# Altium schematic sheet HVP012A.SchDoc
size 431 x 279 mm; Date: Not shown in title block; ApprovedBy: Not shown in title block; CheckedBy: Not shown in title block; Author: Not shown in title block; CompanyName: Not shown in title block; Engineer: Not shown in title block; Organization: Not shown in title block; Address1: Not shown in title block; Address2: Not shown in title block; Address3: Not shown in title block; Address4: Not shown in title block; DocumentNumber: 1; Revision: Use project parameter SCH_Rev; SheetNumber: 1; SheetTotal: 1; PageSetup: Record=PageOptions|CenterHorizontal=True|CenterVertical=True|PrintScale=0.64|XCorrection=1.00|YCorrection=1.00|PrintKind=0|BorderSize=5000000|LeftOffset=0|BottomOffset=0|Orientation=2|PaperLength=1000|PaperWidth=1000|Scale=100|PaperSource=15|PrintQuality=600|MediaType=1|DitherType=10|PrintScaleMode=1|PaperKind=Letter; CurrentTime: Not shown in title block; CurrentDate: Not shown in title block; Time: Not shown in title block; DocumentFullPathAndName: Not shown in title block; DocumentName: Not shown in title block; ModifiedDate: Not shown in title block; ImagePath: Not shown in title block
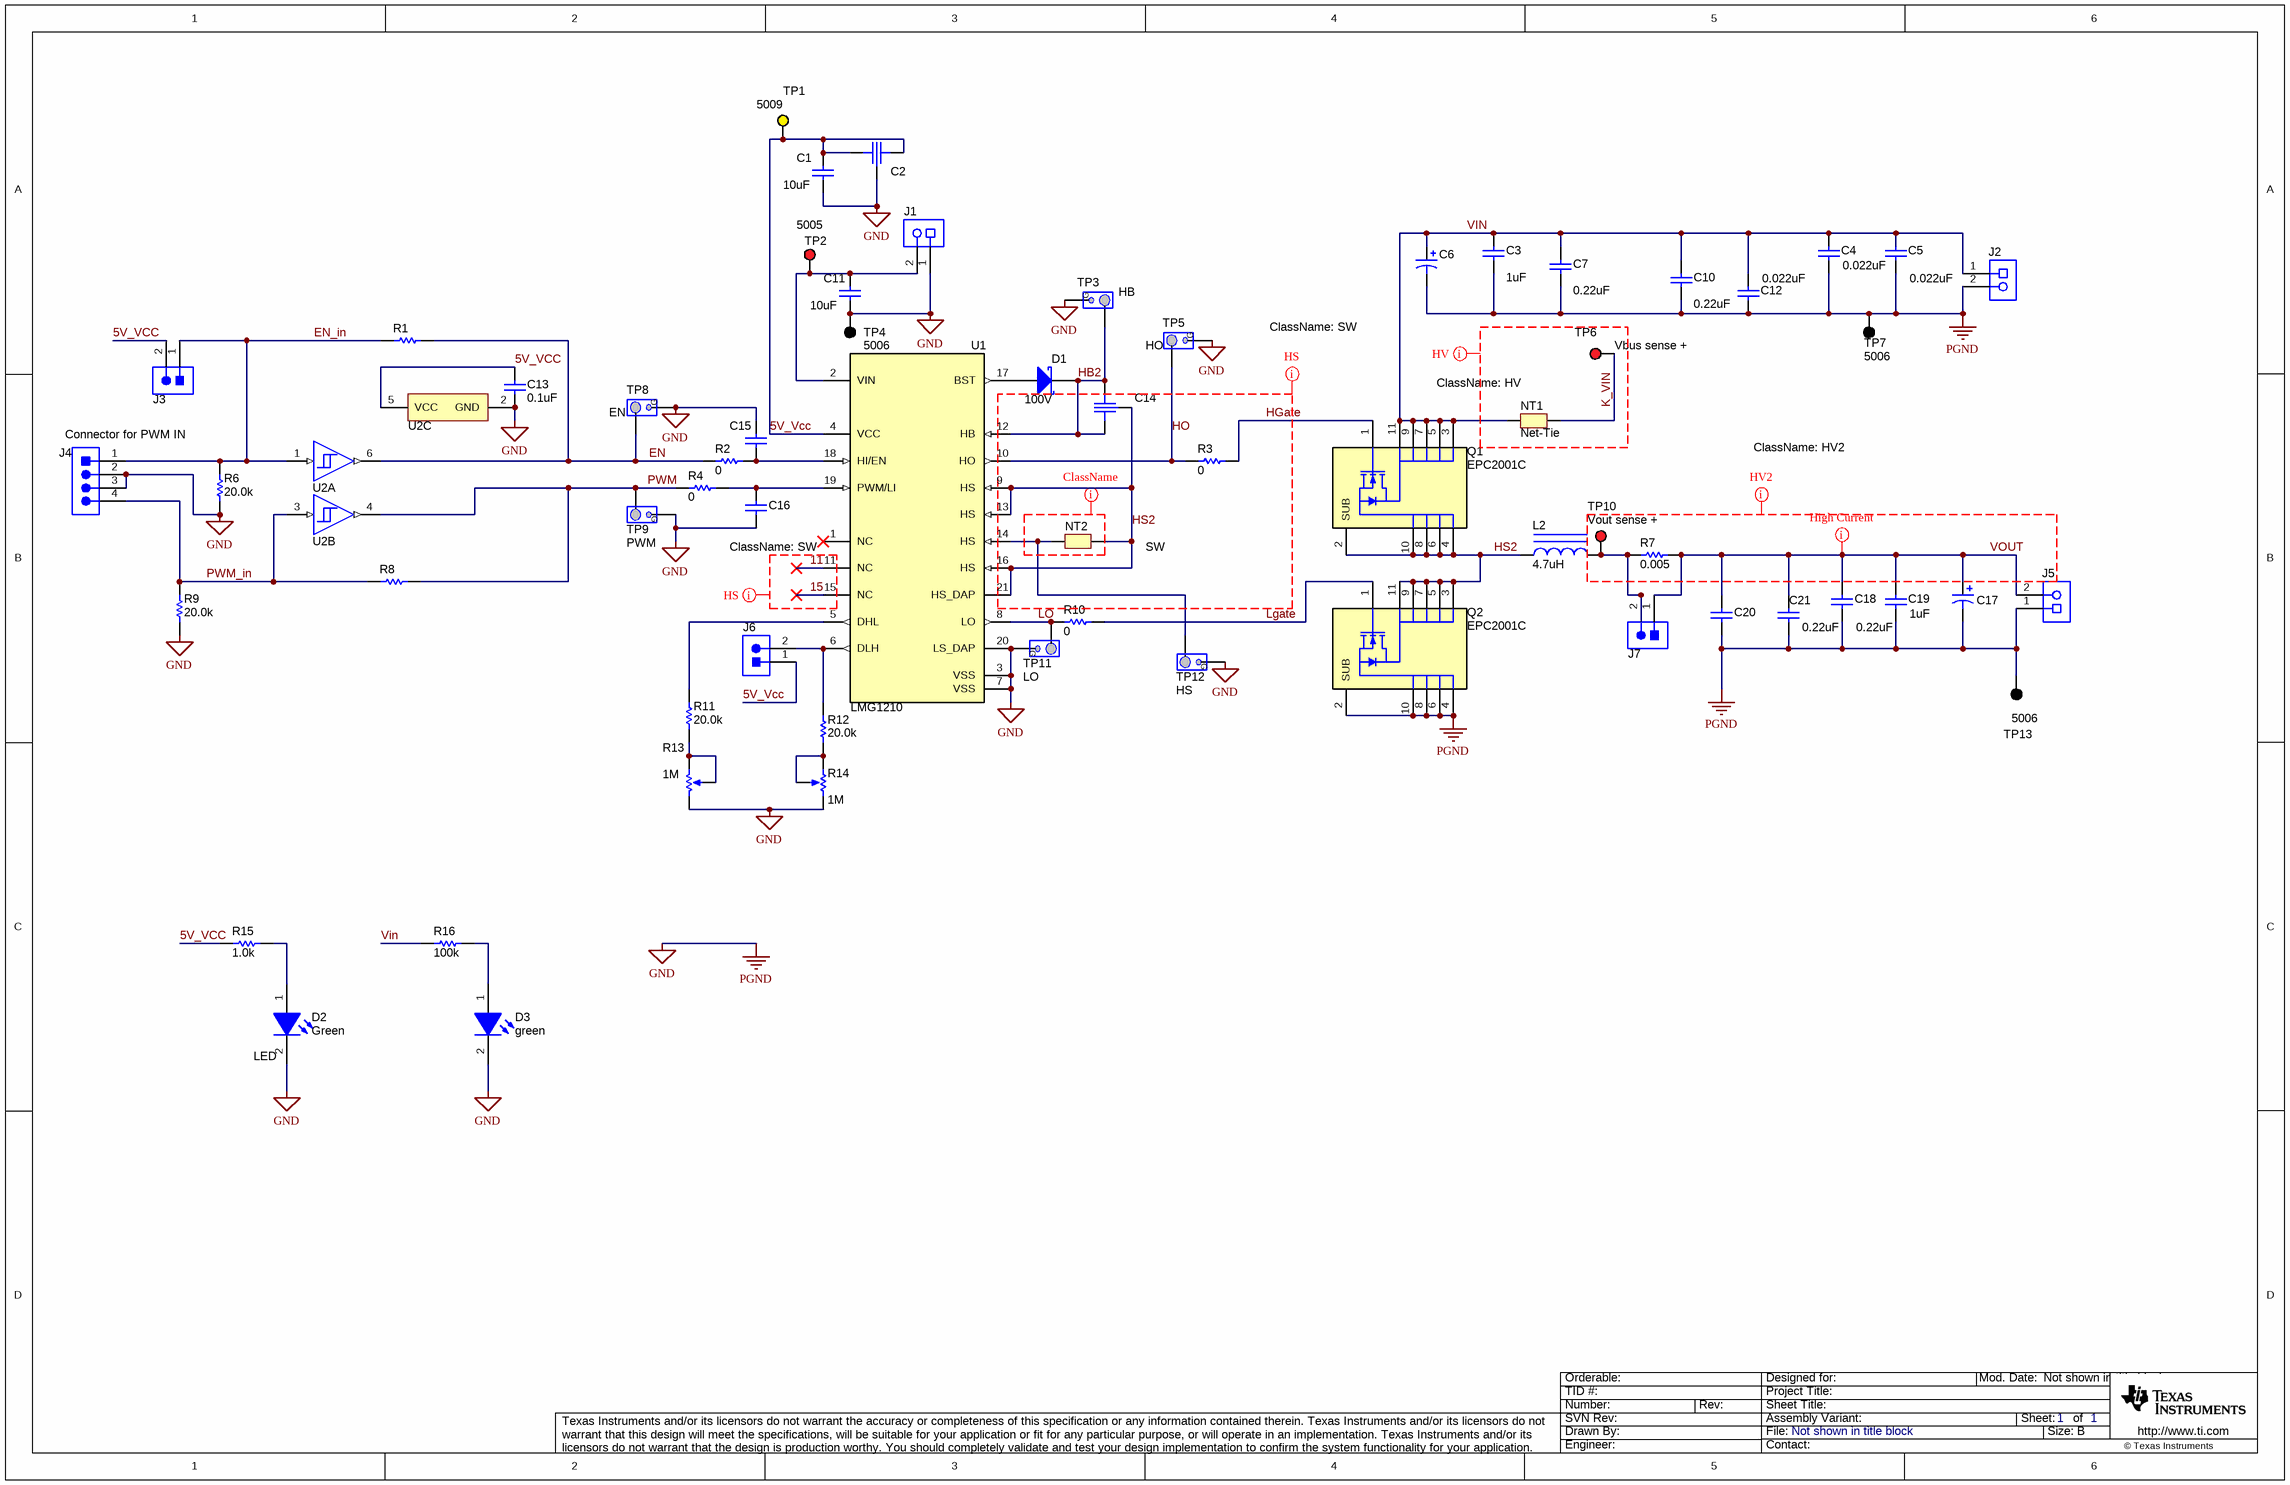
[diagram p0: HVP012A.SchDoc]

## Parts
(Parts that share a designator on the sheet are numbered #1, #2 ... from top to bottom, then left to right.)
C1  ValueDisplayed: 10uF  [1206]  (hidden comment: Capacitor)
C2  Capacitor_Balanced  [YFF18PW]  (value not drawn)
C3  ValueDisplayed: 1uF  [2220_200]  (hidden comment: Capacitor)
C4  ValueDisplayed: 0.022uF  [0805_HV]  (hidden comment: Capacitor)
C5  ValueDisplayed: 0.022uF  [0805_HV]  (hidden comment: Capacitor)
C6  Cap_Polarized  [CAPSMT_62_F60]  (value not drawn)
C7  ValueDisplayed: 0.22uF  [1210_220]  (hidden comment: Capacitor)
C10  ValueDisplayed: 0.22uF  [1210_220]  (hidden comment: Capacitor)
C11  ValueDisplayed: 10uF  [1206]  (hidden comment: Capacitor)
C12  ValueDisplayed: 0.022uF  [0805_HV]  (hidden comment: Capacitor)
C13  ValueDisplayed: 0.1uF  [0603]  (hidden comment: Capacitor)
C14  Capacitor_Balanced  [YFF18PW]  (value not drawn)
C15  Capacitor  [0402]  (value not drawn)
C16  Capacitor  [0402]  (value not drawn)
C17  Cap_Polarized  [CAPSMT_62_H70]  (value not drawn)
C18  ValueDisplayed: 0.22uF  [1210_220]  (hidden comment: Capacitor)
C19  ValueDisplayed: 1uF  [2220_200]  (hidden comment: Capacitor)
C20  Capacitor  [1210_220]  (value not drawn)
C21  ValueDisplayed: 0.22uF  [1210_220]  (hidden comment: Capacitor)
D1  value 100V  [SOD-323F]  (hidden comment: BAT46WJ,115)
D2  LED  value Green  [LTST-C170KGKT_Green]
D3  green  [LTST-C170KGKT_Green]
J1  Receptacle_2x1  [On-Shore_OSTVN02A150]  (value not drawn)
J2  Receptacle_2x1  [TEC_282841-2]  (value not drawn)
J3  Header_2x1  [Sullins_Gxx02SAAN]  (value not drawn)
J4  Header_4x1  [TE_5-146278-4]  (value not drawn)
J5  Receptacle_2x1  [TEC_282841-2]  (value not drawn)
J6  Header_2x1  [Sullins_Gxx02SAAN]  (value not drawn)
J7  Header_2x1  [Sullins_Gxx02SAAN]  (value not drawn)
L2  ValueDisplayed: 4.7uH  [XAL8080]  (hidden comment: Inductor_Iron)
NT1  Net-Tie  [Net-Tie_10milWide_30milLong]  (net tie, no BOM)
NT2  Net-Tie  [Net-Tie_10milWide_30milLong]  (value not drawn)  (net tie, no BOM)
Q1  EPC2001C  [EPC2001]
Q2  EPC2001C  [EPC2001]
R1  Resistor  [0402]  (value not drawn)
R2  ValueDisplayed: 0  [0402]  (hidden comment: Resistor)
R3  ValueDisplayed: 0  [0201]  (hidden comment: Resistor)
R4  ValueDisplayed: 0  [0402]  (hidden comment: Resistor)
R6  ValueDisplayed: 20.0k  [0402]  (hidden comment: Resistor)
R7  ValueDisplayed: 0.005  [0612]  (hidden comment: PRL1632-R005-F-T1)
R8  Resistor  [0402]  (value not drawn)
R9  ValueDisplayed: 20.0k  [0402]  (hidden comment: Resistor)
R10  ValueDisplayed: 0  [0201]  (hidden comment: Resistor)
R11  ValueDisplayed: 20.0k  [0201]  (hidden comment: Resistor)
R12  ValueDisplayed: 20.0k  [0201]  (hidden comment: Resistor)
R13  value 1M  [TRIM_3224X]  (hidden comment: Potentiometer)
R14  value 1M  [TRIM_3224X]  (hidden comment: Potentiometer)
R15  value 1.0k  [0603]  (hidden comment: Resistor)
R16  ValueDisplayed: 100k  [1206]  (hidden comment: Resistor)
TP1  5009  [Keystone5009]
TP2  5005  [Keystone5005]
TP3  HB  [TESTPOINT_PIGTAIL]  (no BOM)
TP4  5006  [Keystone5006]
TP5  HO  [TESTPOINT_PIGTAIL]  (no BOM)
TP6  Vbus sense +  [Keystone5000]
TP7  5006  [Keystone5006]
TP8  EN  [TESTPOINT_PIGTAIL]  (no BOM)
TP9  PWM  [TESTPOINT_PIGTAIL]  (no BOM)
TP10  Vout sense +  [Keystone5000]
TP11  LO  [TESTPOINT_PIGTAIL]  (no BOM)
TP12  HS  [TESTPOINT_PIGTAIL]  (no BOM)
TP13  5006  [Keystone5006]
U1  LMG1210  [RVR0019A]
U2#1  SN74LVC2G17DBVR  [DBV0006A_N]  (value not drawn)  (parts A,C of 3)
U2#2  SN74LVC2G17DBVR  [DBV0006A_N]  (value not drawn)  (part B of 3)

## Nets
GND: C1.2 C2.3 C3.2 C4.2 C5.2 C6.2(-) C7.2 C10.2 C11.1 C12.2 C13.2 C15.1 C16.2 C17.2(-) C18.2 C19.2 C20.2 C21.2 D2.2(K) D3.2(K) J1.1 J2.2 J4.2 J4.3 J5.1 Q2.2(SUB) Q2.4(S) Q2.6(S) Q2.8(S) Q2.10(S) R6.1 R9.1 R13.3(CW) R14.3(CW) TP3.2 TP4.1 TP5.2 TP7.1 TP8.2 TP9.2 TP11.2 TP12.2 TP13.1 U1.3(VSS) U1.7(VSS) U1.20(LS_DAP) U2#1.2(GND)  [also labelled PGND]
5V_Vcc: C1.1 C2.1 C2.2 C13.1 J3.2 J6.1 R15.1 TP1.1 U1.4(VCC) U2#1.5(VCC)
11: U1.11(NC)
15: U1.15(NC)
EN: R1.2 R2.1 TP8.1 U2#1.6(1Y)
EN_in: J3.1 J4.1 R1.1 R6.2 U2#1.1(1A)
HB2: C14.1 C14.2 D1.1(K) TP3.1 U1.12(HB)
HGate: Q1.1(G) R3.2
HO: R3.1 TP5.1 U1.10(HO)
HS2: C14.3 L2.1 NT2.2 Q1.2(SUB) Q1.4(S) Q1.6(S) Q1.8(S) Q1.10(S) Q2.3(D) Q2.5(D) Q2.7(D) Q2.9(D) Q2.11(D) U1.9(HS) U1.13(HS) U1.16(HS) U1.21(HS_DAP)
K_VIN: NT1.2 TP6.1
Lgate: Q2.1(G) R10.2
LO: R10.1 TP11.1 U1.8(LO)
PWM: R4.1 R8.2 TP9.1 U2#2.4(2Y)
PWM_in: J4.4 R8.1 R9.2 U2#2.3(2A)
Vin: C3.1 C4.1 C5.1 C6.1(+) C7.1 C10.1 C12.1 J2.1 NT1.1 Q1.3(D) Q1.5(D) Q1.7(D) Q1.9(D) Q1.11(D) R16.1
VOUT: C17.1(+) C18.1 C19.1 C20.1 C21.1 J5.2 J7.1 R7.2
NetC11_2: C11.2 J1.2 TP2.1 U1.2(VIN)
NetC15_2: C15.2 R2.2 U1.18(HI/EN)
NetC16_1: C16.1 R4.2 U1.19(PWM/LI)
NetD1_2: D1.2(A) U1.17(BST)
NetD2_1: D2.1(A) R15.2
NetD3_1: D3.1(A) R16.2
NetJ6_2: J6.2 R12.2 U1.6(DLH)
NetJ7_2: J7.2 L2.2 R7.1 TP10.1
NetNT2_1: NT2.1 TP12.1 U1.14(HS)
NetR11_1: R11.1 R13.1(CCW) R13.2(WIPER)
NetR11_2: R11.2 U1.5(DHL)
NetR12_1: R12.1 R14.1(CCW) R14.2(WIPER)

Not connected (* = marked no-connect by the designer): U1 1(NC)*

## Layout directives
mark named High Current: VOUT
net class HV: K_VIN
net class SW: 11, 15, HGate, HO, HS2
net class HV2: VOUT

## Notes on the sheet
- (near J4) Connector for PWM IN
- Drawn By:
- SVN Rev:
- Number:
- TID #:
- Orderable:
- Rev:
- Sheet Title:
- File:
- Project Title:
- Designed for:
- Assembly Variant:
- Mod. Date:
- Sheet:
- Size:
- of
- B
- http://www.ti.com
- Texas Instruments and/or its licensors do not warrant the accuracy or completeness of this specification or any information contained therein. Texas Instruments and/or its licensors do not warrant that this design will meet the specifications, will be suitable for your application or fit for any particular purpose, or will operate in an implementation. Texas Instruments and/or its licensors do not warrant that the design is production worthy. You should completely validate and test your design implementation to confirm the system functionality for your application.
- Engineer:
- Contact:
- © Texas Instruments
- (in symbol CMP-0003907-1) G

## Library data of the parts
C1 C11 = CMP-0008574-2: CAP, CERM, 10 uF, 25 V, +/- 10%, X7R, 1206; PartNumber: 885012208069; Manufacturer: Wurth Elektronik; Polarized: N; Value: 10uF; U/M: EA; Cap_F: 10µF; Value1: Unknown; VDC_V: 25V; TaMin_C: -55°C; TaMax_C: 125°C; AEC Category: Q200; SizeArea_mm2: 5.12; SizeAreaWB_mm2: 10.92; SizeX_mm: 3.2; SizeY_mm: 1.6; SizeZ_mm: 1.35; CompType: Capacitor; PackageReference: 1206; RoHS: Y; Tolerance_%: 10%; Value2: 25V; MountType: SMT; Technology: Ceramic; TempCo: X7R; Cap_Case: 1206; Published: 2008-06-19; Publisher: Texas Instruments; LatestRevisionDate: 2017-03-09; ComponentLink1Description: Datasheet link; ComponentLink1URL: http://katalog.we-online.de/pbs/datasheet/885012208069.pdf; Supplier 1: Digi-Key; Supplier Part Number 1: 732-7574-1-ND; Supplier 2: Mouser; Supplier Part Number 2: 710-885012208069; AEC Qualified: N; AEC Grade: N/A
C2 C14 = CMP-0002107-2: Feedthru Capacitor, 0.47uF, 6.3V, SMD; PartNumber: YFF18PW0J474M; Manufacturer: TDK; CompType: Filter; Value: 0.47uF; MountType: SMT; ComponentLink1Description: Datasheet URL; ComponentLink1URL: http://product.tdk.com/en/catalog/datasheets/emc_esr_yff-p_en.pdf; RoHS: Y; PackageReference: 0603; Publisher: Texas Instruments; LatestRevisionDate: 09/03/2017; Supplier 1: Digi-Key; Supplier Part Number 1: 445-3028-1-ND; Supplier 2: Mouser; Supplier Part Number 2: 810-CKD61BJB0J474S
C3 C19 = CMP-0009465-2: CAP, CERM, 1 uF, 250 V, +/- 10%, X7R, 2220; PartNumber: GRM55DR72E105KW01L; Manufacturer: MuRata; Polarized: N; Value: 1uF; U/M: EA; Cap_F: 1µF; ESR_ohm: 7.086m; Value1: 0.007086 ohm; VDC_V: 250V; IRMS_A: 2.0605A; TaMin_C: -55°C; TaMax_C: 125°C; Cap_Case: 2220; SizeArea_mm2: 28.5; SizeAreaWB_mm2: 53.9; SizeX_mm: 5.7; SizeY_mm: 5; SizeZ_mm: 2; AEC Category: Q200; CompType: Capacitor; PackageReference: 2220; RoHS: Y; Tolerance_%: 10%; Value2: 250V; MountType: SMT; Technology: Ceramic; TempCo: X7R; Published: 2008-06-19; Publisher: Texas Instruments; LatestRevisionDate: 2017-03-09; ComponentLink1Description: Datasheet link; ComponentLink1URL: http://psearch.en.murata.com/capacitor/product/GRM55DR72E105KW01%23.pdf; Supplier 1: Digi-Key; Supplier Part Number 1: 490-3550-1-ND; Supplier 2: Newark; Supplier Part Number 2: 14T3417; Supplier 3: Mouser; Supplier Part Number 3: 81-GRM55RR72E105K; AEC Qualified: N; AEC Grade: N/A
C4 C5 C12 = CMP-0008410-2: CAP, CERM, 0.022 uF, 250 V, +/- 10%, X7R, 0805; PartNumber: QMK212B7223KG-T; Manufacturer: Taiyo Yuden; Polarized: N; U/M: EA; Cap_F: 22nF; Value1: Unknown; VDC_V: 250V; TaMin_C: -55°C; TaMax_C: 125°C; Cap_Case: 0805; SizeArea_mm2: 2.5; SizeAreaWB_mm2: 6.75; SizeX_mm: 2; SizeY_mm: 1.25; SizeZ_mm: 1.45; AEC Category: Q200; CompType: Capacitor; Value: 0.022uF; PackageReference: 0805; RoHS: Y; Tolerance_%: 10%; Value2: 250V; MountType: SMT; Technology: Ceramic; TempCo: X7R; Published: 2008-06-19; Publisher: Texas Instruments; LatestRevisionDate: 2017-03-09; ComponentLink1Description: Datasheet link; ComponentLink1URL: http://www.yuden.co.jp/ut/product/pdf/dhmk_e.pdf; Supplier 1: Digi-Key; Supplier Part Number 1: 587-1272-1-ND; Supplier 2: Newark; Supplier Part Number 2: 77M8478; Supplier 3: Farnell; Supplier Part Number 3: 1683685; AEC Qualified: ?
C6 = CMP-0010616-1: CAP, AL, 22 uF, 20 V, +/- 20%, 0.06 ohm, SMD; PartNumber: APXH200ARA220MF60G; Manufacturer: Chemi-Con; Polarized: Y; CompType: Capacitor; Value: 22uF; U/M: EA; Cap_F: 22µF; VDC_V: 20V; ESR_ohm: 0.06; IRMS_A: 1.65A; TaMin_C: -55°C; TaMax_C: 125°C; Cap_Case: F60; SizeAreaWB_mm2: 77.44; SizeArea_mm2: 46.24; SizeX_mm: 6.8; SizeZ_mm: 6; AEC Category: Q200; ValueDisplayed: 22uF; PackageReference: F60; RoHS: Y; Tolerance_%: 20%; Value1: 0.06 ohm; Value2: 20V; MountType: SMT; Technology: AL; Series: PXH; SizeY_mm: 6.8; Publisher: Texas Instruments; LatestRevisionDate: 2017-03-09; ComponentLink1Description: Datasheet link; ComponentLink1URL: http://www.chemi-con.co.jp/cgi-bin/CAT_DB/SEARCH/cat_db_al.cgi?e=e&j=p&pdfname=pxh; Supplier 1: Digi-Key; Supplier Part Number 1: 565-3149-1-ND; Supplier 2: Mouser; Supplier Part Number 2: 661-PXH20V220M; AEC Qualified: ?
C7 C10 C18 C20 C21 = CMP-0009193-2: CAP, CERM, 0.22 uF, 250 V, +/- 10%, X7R, 1210; PartNumber: GRM32DR72E224KW01L; Manufacturer: MuRata; Polarized: N; Value: 0.22uF; U/M: EA; Cap_F: 220nF; Value1: Unknown; VDC_V: 250V; TaMin_C: -55°C; TaMax_C: 125°C; Cap_Case: 1210; SizeArea_mm2: 8; SizeAreaWB_mm2: 14.7; SizeX_mm: 3.2; SizeY_mm: 2.5; SizeZ_mm: 2.2; AEC Category: Q200; CompType: Capacitor; PackageReference: 1210; RoHS: Y; Tolerance_%: 10%; Value2: 250V; MountType: SMT; Technology: Ceramic; TempCo: X7R; Published: 2008-06-19; Publisher: Texas Instruments; LatestRevisionDate: 2017-03-09; ComponentLink1Description: Datasheet link; ComponentLink1URL: http://search.murata.co.jp/Ceramy/PnsearchViewAction.do?HnOFG=ON&HnNFG=ON&SEL_CNT=50&sLang=en&sKey=GRM32DR72E224KW01L&x=9&y=9&search=startwith; Supplier 1: Digi-Key; Supplier Part Number 1: 490-3545-1-ND; Supplier 2: Mouser; Supplier Part Number 2: 81-GRM32DR72E224KW01; Supplier 3: Farnell; Supplier Part Number 3: 1828959; AEC Qualified: ?
  C20: ValueDisplayed: 0.22uF
C13 = CMP-0007404-4: CAP, CERM, 0.1 uF, 25 V, +/- 10%, X7R, 0603; PartNumber: GRM188R71E104KA01D; Manufacturer: MuRata; Polarized: N; Value: 0.1uF; U/M: EA; Cap_F: 100nF; Value1: Unknown; VDC_V: 25V; TaMin_C: -55°C; TaMax_C: 125°C; AEC Category: Q200; SizeArea_mm2: 1.28; SizeAreaWB_mm2: 4.68; SizeX_mm: 1.6; SizeY_mm: 0.8; SizeZ_mm: 1; CompType: Capacitor; RoHS: Y; Tolerance_%: 10%; Value2: 25V; MountType: SMT; Technology: Ceramic; TempCo: X7R; Cap_Case: 0603; Published: 2008-06-19; Publisher: Texas Instruments; LatestRevisionDate: 2017-03-09; ComponentLink1Description: Datasheet link; ComponentLink1URL: http://search.murata.co.jp/Ceramy/PnsearchViewAction.do?HnOFG=ON&HnNFG=ON&SEL_CNT=50&sLang=en&sKey=GRM188R71E104KA01D&x=9&y=9&search=startwith; Supplier 1: Digi-Key; Supplier Part Number 1: 490-1524-1-ND; Supplier 2: Mouser; Supplier Part Number 2: 81-GRM39X104K25; Supplier 3: Farnell; Supplier Part Number 3: 1828899; AEC Qualified: ?; PackageReference: 0603
C15 C16 = CMP-0006207-2: CAP, CERM, 10 pF, 50 V, +/- 5%, C0G/NP0, 0402; PartNumber: 500R07S100JV4T; Manufacturer: Johanson Technology; Polarized: N; Value: 10pF; U/M: EA; Value1: Unknown; VDC_V: 50V; TaMin_C: -55°C; TaMax_C: 125°C; SizeArea_mm2: 0.5; SizeAreaWB_mm2: 3; SizeX_mm: 1; SizeZ_mm: 0.6; AEC Category: Q200; CompType: Capacitor; ValueDisplayed: 10pF; PackageReference: 0402; RoHS: Y; Cap_F: 10pF; Tolerance_%: 5%; Value2: 50V; MountType: SMT; Technology: Ceramic; TempCo: C0G/NP0; Cap_Case: 0402; SizeY_mm: 0.5; Published: 2008-06-19; Publisher: Texas Instruments; LatestRevisionDate: 2017-03-09; ComponentLink1Description: Datasheet link; ComponentLink1URL: http://www.johansontechnology.com/images/stories/catalog/JTI_CAT_2012_MLCC_HighQ.pdf; AEC Qualified: ?
C17 = CMP-0010617-1: CAP, AL, 47 uF, 20 V, +/- 20%, 0.045 ohm, SMD; PartNumber: APXH200ARA470MH70G; Manufacturer: Chemi-Con; Polarized: Y; CompType: Capacitor; Value: 47uF; U/M: EA; Cap_F: 47µF; VDC_V: 20V; ESR_ohm: 0.045; IRMS_A: 2A; TaMin_C: -55°C; TaMax_C: 125°C; Cap_Case: H70; SizeAreaWB_mm2: 110.25; SizeArea_mm2: 72.25; SizeX_mm: 8.5; SizeZ_mm: 7; AEC Category: Q200; ValueDisplayed: 47uF; PackageReference: H70; RoHS: Y; Tolerance_%: 20%; Value1: 0.045 ohm; Value2: 20V; MountType: SMT; Technology: AL; Series: PXH; SizeY_mm: 8.5; Publisher: Texas Instruments; LatestRevisionDate: 2017-03-09; ComponentLink1Description: Datasheet link; ComponentLink1URL: http://www.chemi-con.co.jp/cgi-bin/CAT_DB/SEARCH/cat_db_al.cgi?e=e&j=p&pdfname=pxh; Supplier 1: Digi-Key; Supplier Part Number 1: 565-3150-1-ND; Supplier 2: Mouser; Supplier Part Number 2: 661-PXH20V470M; AEC Qualified: ?
D1 = CMP-0076946-1: Diode, Schottky, 100 V, 0.25 A, SOD-323F; Manufacturer: Nexperia; SizeAreaWB_mm2: 7.875; SizeArea_mm2: 3.125; TJmax_C: 150°C; AEC Category: Q101; SizeZ_mm: 0.8; Green_REACh: Incomplete; Io_A: 2.5dA; Vf_V: 8.5dV; SizeY_mm: 1.25; Value2: 0.85V; Green_Lifecycle: Not Set; U/M: EA; Value1: 0.25A; SizeX_mm: 2.5; ComponentLink1Description: Datasheet link; RoHS: Y; Supplier Part Number 3: 771-BAT46WJ115; Supplier 1: Digi-Key; Vr_V: 100V; AEC Qualified: ?; Green_EU RoHS: Incomplete; PackageReference: SOD-323F; PartNumber: BAT46WJ,115; Publisher: Texas Instruments; Supplier Part Number 2: 81R1832; Supplier 2: Newark; Published: 2008-06-26; LatestRevisionDate: 2017-07-25; ComponentLink1URL: http://www.nexperia.com/documents/data_sheet/BAT46WJ.pdf; CompType: Diode; MountType: SMT; Supplier Part Number 1: 568-6017-1-ND; Supplier 3: Mouser; Type: Schottky; Green_EU RoHS-2: Incomplete
D2 = CMP-0002888-1: LED, Green, SMD; Manufacturer: Lite-On; PartNumber: LTST-C170KGKT; Type: AlInGaP; Vf_V: 2V; Io_A: 20mA; Value1: W; U/M: EA; CompType: LED; MountType: SMT; RoHS: Y; PackageReference: LED_0805; Value2: 2V; Color: Green; Published: 2008-07-11; Publisher: Texas Instruments; ComponentLink1URL: http://optoelectronics.liteon.com/upload/download/DS22-2000-073/S_110_LTST-C170KGKT.pdf; ComponentLink1Description: Datasheet link; LatestRevisionDate: 2017-03-09; Supplier 1: Digi-Key; Supplier Part Number 1: 160-1414-1-ND; Supplier 2: Mouser; Supplier Part Number 2: 859-LTST-C170KGKT
D3 = CMP-0002888-1: LED, Green, SMD; Manufacturer: Lite-On; PartNumber: LTST-C170KGKT; Io_A: 20mA; Value1: W; U/M: EA; Vf_V: 2V; Type: AlInGaP; ComponentLink1URL: http://optoelectronics.liteon.com/upload/download/DS22-2000-073/S_110_LTST-C170KGKT.pdf; Supplier Part Number 2: 859-LTST-C170KGKT; Publisher: Texas Instruments; Supplier 2: Mouser; Color: Green; Published: 2008-07-11; RoHS: Y; MountType: SMT; Value: Green; Supplier 1: Digi-Key; PackageReference: LED_0805; Value2: 2V; CompType: LED; LatestRevisionDate: 2017-03-09; ComponentLink1Description: Datasheet link; Supplier Part Number 1: 160-1414-1-ND
J1 = CMP-0075076-1: Terminal Block, 2.54mm, 2x1, Brass, TH; PartNumber: OSTVN02A150; Manufacturer: On-Shore Technology; CNHeader: False; CT: True; Green_Lifecycle: Not Set; Green_REACh: Incomplete; PackageReference: Terminal Block, 2.54mm, 2-pole, Brass, TH; CompType: Terminal Block; RoHS: Y; MountType: TH; ComponentLink1Description: Datasheet URL; ComponentLink1URL: http://www.on-shore.com/sites/default/files/manuals/ostvnxxa150.pdf; Publisher: Texas Instruments; LatestRevisionDate: 2017-07-12; Supplier 1: Digi-Key; Supplier Part Number 1: ED10561-ND; Green_EU RoHS-2: Incomplete; Green_EU RoHS: Incomplete
J2 J5 = CMP-0054973-1: Terminal Block, 2x1, 5.08mm, TH; PartNumber: 282841-2; Manufacturer: TE Connectivity; CNHeader: FALSE; CT: TRUE; Green_Lifecycle: Active; Green_REACh: Passed; PackageReference: 10.16x15.2x9mm; CompType: Terminal Block; RoHS: Y; MountType: TH; ComponentLink1Description: Datasheet URL; ComponentLink1URL: http://www.te.com/commerce/DocumentDelivery/DDEController?Action=srchrtrv&DocNm=282841&DocType=Customer+Drawing&DocLang=English; Publisher: Texas Instruments; LatestRevisionDate: 26/05/2017; Supplier 1: Digi-Key; Supplier Part Number 1: A98342-ND; Supplier 2: Newark; Supplier Part Number 2: 12H8419; Supplier 3: Mouser; Supplier Part Number 3: 571-2828412; Green_EU RoHS-2: Incomplete; Green_EU RoHS: Passed with Exemption
J3 J6 J7 = CMP-0054576-1: Header, 2.54 mm, 2x1, Gold, TH; PartNumber: GBC02SAAN; Manufacturer: Sullins Connector Solutions; CNHeader: TRUE; CT: FALSE; PackageReference: Header, 2.54 mm, 2x1, TH; ClassName: Header; CompType: Header; RoHS: Y; MountType: TH; ComponentLink1Description: Datasheet URL; ComponentLink1URL: http://www.sullinscorp.com/catalogs/111_PAGE110-111_.100_MALE_HDR.pdf; Publisher: Texas Instruments; LatestRevisionDate: 26/05/2017
J4 = CMP-0054950-1: Header, 100mil, 4x1, Tin, TH; PartNumber: 5-146278-4; Manufacturer: TE Connectivity; CNHeader: TRUE; CT: FALSE; Green_Lifecycle: Active; Green_REACh: Passed; PackageReference: Header, 4x1, 100mil, TH; ClassName: Header; CompType: Header; RoHS: Y; MountType: TH; ComponentLink1Description: Datasheet URL; ComponentLink1URL: http://www.te.com/commerce/DocumentDelivery/DDEController?Action=srchrtrv&DocNm=146278&DocType=Customer+Drawing&DocLang=English; Publisher: Texas Instruments; LatestRevisionDate: 26/05/2017; Supplier 1: Digi-Key; Supplier Part Number 1: 5-146278-4-ND; Supplier 2: Newark; Supplier Part Number 2: 40P2617; Supplier 3: Mouser; Supplier Part Number 3: 571-5-146278-4; Green_EU RoHS-2: Incomplete; Green_EU RoHS: Passed
L2 = CMP-0061062-1: Inductor, Shielded, Composite, 4.7 uH, 10.5 A, 0.00889 ohm, SMD; PartNumber: XAL8080-472ME; Manufacturer: Coilcraft; Value: 4.7uH; Ind_H: 4.7µH; Imax_A: 10.5A; Irms: 10.5A @ 20C rise; Isat: 17.4A @ 20% inductance drop; DCR_ohm: 8.89m; SizeAreaWB_mm2: 107.06; SizeArea_mm2: 69.66; SizeX_mm: 8.1; SizeY_mm: 8.6; SizeZ_mm: 8; AEC Category: Q200; Green_Lifecycle: Not Set; Green_REACh: Incomplete; CompType: Inductor; Value1: 0.00889 ohm; Value2: 10.5A; Technology: Shielded; MountType: SMT; Material: Composite; PackageReference: 8.1 x 8 x 8.6mm; Published: 2008-06-26; Publisher: Texas Instruments; LatestRevisionDate: 2017-06-02; ComponentLink1Description: Datasheet link; ComponentLink1URL: http://www.coilcraft.com/pdfs/xal8080.pdf; RoHS: Y; Supplier 1: Mouser; Supplier Part Number 1: 994-XAL8080-472MEB; Supplier 2: Farnell; Supplier Part Number 2: 2289135; AEC Qualified: ?; Green_EU RoHS-2: Incomplete; Green_EU RoHS: Incomplete
NT1 NT2 = CMP-0078142-1: Single point connection between nets.; MountType: SMT; CompType: Net-Tie; Manufacturer: N/A; PackageReference: N/A; PartNumber: N/A; Library Reference: Net-Tie
Q1 Q2 = CMP-0000972-2: MOSFET, N-CH, 100 V, 36 A, 4.105x1.632mm; Alternate Manufacturer: None; Manufacturer: EPC; SizeZ_mm: 0.815; ChType: N; Value2: 7.5 nC; VdsMax_V: 100V; SizeX_mm: 1.632; SizeAreaWB_mm2: 13.43636; SizeY_mm: 4.105; Vgs_V: 6V; QgTyp_nC: 7.5; Value: 100V; SizeArea_mm2: 6.69936; AEC Category: Q101; IdsMax_A: 36A; U/M: EA; Supplier 1: Digi-Key; Supplier Part Number 1: 917-1079-1-ND; PartNumber: EPC2001C; ComponentLink1Description: Datasheet link; CompType: MOSFET; LatestRevisionNote: Added parts.; Publisher: Texas Instruments; AEC Qualified: N; Published: 2008-06-19; RoHS: Y; LatestRevisionDate: 2017-03-09; PackageReference: 4.105x1.632mm; MountType: SMT; ComponentLink1URL: http://epc-co.com/epc/Portals/0/epc/documents/datasheets/epc2001c_datasheet.pdf; ClassName: FETs
R1 R2 R4 R8 = CMP-0026992-3: RES, 0, 5%, 0.1 W, AEC-Q200 Grade 0, 0402; PartNumber: ERJ-2GE0R00X; Manufacturer: Panasonic; Value: 0; Value_Code: 0000; Power_W: 100mW; Value2: 0.1W; VDC_V: 50V; TempCo: 600 ppm/C; EIA_Code: E24; AEC Category: Q200; AEC Qualified: Y; SizeArea_mm2: 0.5; SizeAreaWB_mm2: 3; SizeX_mm: 1; SizeZ_mm: 0.6; CompType: Resistor; PackageReference: 0402; RoHS: Y; Res_ohm: 0; Tolerance_%: 5%; Value1: 5%; MountType: SMT; Technology: Thick Film; ComponentLink1Description: Datasheet link; ComponentLink1URL: https://industrial.panasonic.com/cdbs/www-data/pdf/RDA0000/AOA0000C301.pdf; Supplier 1: Digi-Key; Supplier Part Number 1: P0.0JCT-ND; Supplier 2: Newark; Supplier Part Number 2: 65T8307; Supplier 3: Mouser; Supplier Part Number 3: 667-ERJ-2GE0R00X; AEC Grade: 0; SizeY_mm: 0.5
  R1 R8: ValueDisplayed: 0
R3 R10 = CMP-0027011-4: RES, 0, 5%, 0.05 W, AEC-Q200 Grade 1, 0201; PartNumber: ERJ-1GE0R00C; Manufacturer: Panasonic; Value: 0; Value_Code: 0000; Power_W: 50mW; Value2: 0.05W; VDC_V: 15V; TempCo: 600 ppm/C; SizeArea_mm2: 0.18; SizeAreaWB_mm2: 2.08; SizeX_mm: 0.6; SizeY_mm: 0.3; SizeZ_mm: 0.26; EIA_Code: E24; AEC Category: Q200; AEC Qualified: Y; AEC Grade: 1; CompType: Resistor; PackageReference: 0201; RoHS: Y; Res_ohm: 0; Tolerance_%: 5%; Value1: 5%; MountType: SMT; Technology: Thick Film; ComponentLink1Description: Datasheet link; ComponentLink1URL: https://industrial.panasonic.com/cdbs/www-data/pdf/RDA0000/AOA0000C301.pdf; Supplier 1: Digi-Key; Supplier Part Number 1: P0.0AGCT-ND; Supplier 2: Newark; Supplier Part Number 2: 53W4043; Supplier 3: Mouser; Supplier Part Number 3: 667-ERJ-1GE0R00C
R6 R9 = CMP-0026162-2: RES, 20.0 k, 1%, 0.063 W, AEC-Q200 Grade 0, 0402; PartNumber: CRCW040220K0FKED; Manufacturer: Vishay-Dale; Value: 20.0k; Res_ohm: 20k; Value_Code: 20k0; Power_W: 63mW; Value2: 0.063W; VDC_V: 50V; TempCo: 100 ppm/C; SizeArea_mm2: 0.5; SizeX_mm: 1; SizeZ_mm: 0.6; EIA_Code: E96; AEC Category: Q200; AEC Qualified: Y; AEC Grade: 0; CompType: Resistor; PackageReference: 0402; RoHS: E; Tolerance_%: 1%; Value1: 1%; MountType: SMT; Technology: Thick Film; SizeY_mm: 0.5; ComponentLink1Description: Datasheet link; ComponentLink1URL: http://www.vishay.com/docs/20035/dcrcwe3.pdf; Supplier 1: Digi-Key; Supplier Part Number 1: 541-20.0KLCT-ND; Supplier 2: Newark; Supplier Part Number 2: 52K6817; Supplier 3: Mouser; Supplier Part Number 3: 71-CRCW0402-20K-E3
R7 = CMP-0015203-2: RES, 0.005, 1%, 1 W, 0612; Manufacturer: Susumu Co Ltd; Power_W: 1W; TempCo: 350 ppm/C; SizeAreaWB_mm2: 10.92; Value_Code: 5L000; U/M: EA; Value: 0.005; EIA_Code: E96; Res_ohm: 5m; SizeX_mm: 1.6; SizeY_mm: 3.2; SizeZ_mm: 0.85; SizeArea_mm2: 5.12; AEC Category: Q200; Supplier Part Number 2: 754-PRL1632-R005-FT1; Publisher: Texas Instruments; Supplier 2: Mouser; Supplier Part Number 3: 1266208; Supplier 3: Farnell; Published: 2008-06-26; RoHS: Y; Value1: 1%; MountType: SMT; Supplier 1: Digi-Key; PackageReference: 0612; Tolerance_%: 1%; Value2: 1W; CompType: Resistor; LatestRevisionDate: 2017-03-09; PartNumber: PRL1632-R005-F-T1; AEC Qualified: ?; ComponentLink1Description: Datasheet link; Supplier Part Number 1: PRL1632.005FCT-ND; Technology: Thin Film; ComponentLink1URL: http://www.susumu-usa.com/common/pdf/PRL_RL_Data_sheet.pdf
R11 R12 = CMP-0027269-3: RES, 20.0 k, 1%, 0.05 W, 0201; PartNumber: CRCW020120K0FKED; Manufacturer: Vishay-Dale; Value: 20.0k; Res_ohm: 20k; Value_Code: 20k0; Power_W: 50mW; Value2: 0.05W; VDC_V: 30V; TempCo: 100 ppm/C; SizeArea_mm2: 0.18; SizeX_mm: 0.6; SizeY_mm: 0.3; SizeZ_mm: 0.26; EIA_Code: E96; AEC Category: Q200; AEC Qualified: N; CompType: Resistor; PackageReference: 0201; RoHS: E; Tolerance_%: 1%; Value1: 1%; MountType: SMT; Technology: Thick Film; ComponentLink1Description: Datasheet link; ComponentLink1URL: http://www.vishay.com/docs/20052/crcw0201e3.pdf; Supplier 1: Digi-Key; Supplier Part Number 1: 541-20.0KAABCT-ND; Supplier 2: Newark; Supplier Part Number 2: 63R7663; Supplier 3: Mouser; Supplier Part Number 3: 71-CRCW020120K0FKED; AEC Grade: N/A
R13 R14 = CMP-0002063-2: TRIMMER 1M OHM 0.25W SMD; PartNumber: 3224X-1-105E; Manufacturer: Bourns; CompType: Trimmer; MountType: SMT; ComponentLink1Description: Datasheet URL; ComponentLink1URL: http://www.bourns.com/data/global/pdfs/3224.pdf; RoHS: Y; PackageReference: 3.5x5.3x4.8mm; Publisher: Texas Instruments; LatestRevisionDate: 09/03/2017; Supplier 1: Digi-Key; Supplier Part Number 1: 3224X-1-105ECT-ND; Supplier 2: Mouser; Supplier Part Number 2: 652-3224X-1-105E
R15 = CMP-0025729-4: RES, 1.0 k, 5%, 0.1 W, AEC-Q200 Grade 0, 0603; PartNumber: CRCW06031K00JNEA; Manufacturer: Vishay-Dale; Res_ohm: 1k; Value_Code: 1k00; Power_W: 100mW; Value2: 0.1W; VDC_V: 75V; TempCo: 200 ppm/C; EIA_Code: E24; AEC Category: Q200; AEC Grade: 0; AEC Qualified: Y; SizeArea_mm2: 1.28; SizeX_mm: 1.6; SizeY_mm: 0.8; SizeZ_mm: 1; CompType: Resistor; PackageReference: 0603; RoHS: E; Tolerance_%: 5%; Value1: 5%; MountType: SMT; Technology: Thick Film; ComponentLink1Description: Datasheet link; ComponentLink1URL: http://www.vishay.com/docs/20035/dcrcwe3.pdf; Supplier 1: Digi-Key; Supplier Part Number 1: 541-1.0KGCT-ND; Supplier 2: Newark; Supplier Part Number 2: 59M6750; Supplier 3: Mouser; Supplier Part Number 3: 71-CRCW0603J-1.0K-E3; ValueDisplayed: 1.0k
R16 = CMP-0018574-3: RES, 100 k, 5%, 0.25 W, AEC-Q200 Grade 0, 1206; PartNumber: CRCW1206100KJNEA; Manufacturer: Vishay-Dale; Value: 100k; Power_W: 250mW; Value2: 0.25W; VDC_V: 200V; TempCo: 200 ppm/C; SizeArea_mm2: 5.12; SizeX_mm: 3.2; SizeY_mm: 1.6; SizeZ_mm: 1.35; EIA_Code: E24; AEC Category: Q200; AEC Qualified: Y; AEC Grade: 0; CompType: Resistor; PackageReference: 1206; RoHS: E; Res_ohm: 100k; Value_Code: 100k; Tolerance_%: 5%; Value1: 5%; MountType: SMT; Technology: Thick Film; ComponentLink1Description: Datasheet link; ComponentLink1URL: http://www.vishay.com/docs/20035/dcrcwe3.pdf; Supplier 1: Digi-Key; Supplier Part Number 1: 541-100KECT-ND; Supplier 2: Newark; Supplier Part Number 2: 59M6947; Supplier 3: Farnell; Supplier Part Number 3: 1534576
TP1 = CMP-0055146-1: Test Point, Compact, Yellow, TH; Manufacturer: Keystone; ContactFinish: Silver; CNHeader: FALSE; CT: TRUE; Green_Lifecycle: Active; Green_REACh: Passed; PartNumber: 5009; PackageReference: Yellow Compact Testpoint; CompType: Test Point; RoHS: Y; MountType: TH; ComponentLink1Description: Datasheet URL; ComponentLink1URL: http://www.keyelco.com/userAssets/file/M60-2p60.pdf; Color: Yellow; Publisher: Texas Instruments; LatestRevisionDate: 26/05/2017; Supplier 1: Digi-Key; Supplier Part Number 1: 36-5009-ND; Supplier 2: Mouser; Supplier Part Number 2: 534-5009; Green_EU RoHS-2: Incomplete; Green_EU RoHS: Passed
TP2 = CMP-0055142-1: Test Point, Compact, Red, TH; Manufacturer: Keystone; CNHeader: FALSE; ContactFinish: Silver; CT: TRUE; Green_Lifecycle: Active; Green_REACh: Passed; PartNumber: 5005; PackageReference: Red Compact Testpoint; CompType: Test Point; RoHS: Y; MountType: TH; ComponentLink1Description: Datasheet URL; ComponentLink1URL: http://www.keyelco.com/userAssets/file/M60-2p60.pdf; Publisher: Texas Instruments; LatestRevisionDate: 26/05/2017; Supplier 1: Digi-Key; Supplier Part Number 1: 36-5005-ND; Supplier 2: Mouser; Supplier Part Number 2: 534-5005; Color: Red; Green_EU RoHS-2: Passed; Green_EU RoHS: Passed
TP3 TP5 TP8 TP9 TP11 TP12 = CMP-0003907-1: PIGTAIL; Manufacturer: Texas Instruments; CompType: Test Point; Key: TESTPOINT_PIGTAIL; Publisher: Texas Instruments; PackageReference: Pigtail Test Point; LatestRevisionDate: 2017-03-09; MountType: TH; PartNumber: TESTPOINT_PIGTAIL; ComponentLink1Description: Datasheet Link
TP4 TP7 TP13 = CMP-0055143-1: Test Point, Compact, Black, TH; Manufacturer: Keystone; CNHeader: FALSE; ContactFinish: Silver; CT: TRUE; Green_Lifecycle: Active; Green_REACh: Passed; PartNumber: 5006; PackageReference: Black Compact Testpoint; CompType: Test Point; RoHS: Y; MountType: TH; ComponentLink1Description: Datasheet URL; ComponentLink1URL: http://www.keyelco.com/userAssets/file/M60-2p60.pdf; Publisher: Texas Instruments; LatestRevisionDate: 26/05/2017; Supplier 1: Digi-Key; Supplier Part Number 1: 36-5006-ND; Supplier 2: Mouser; Supplier Part Number 2: 534-5006; Color: Black; Green_EU RoHS-2: Incomplete; Green_EU RoHS: Passed
TP6 TP10 = CMP-0055137-1: Test Point, Miniature, Red, TH; Manufacturer: Keystone; CNHeader: FALSE; Green_Lifecycle: Active; Green_REACh: Passed; ContactFinish: Silver; CT: TRUE; ComponentLink1URL: http://www.keyelco.com/userAssets/file/M60-2p60.pdf; Supplier Part Number 2: 534-5000; Publisher: Texas Instruments; Supplier 2: Mouser; Color: Red; RoHS: Y; MountType: TH; Green_EU RoHS-2: Incomplete; Supplier 1: Digi-Key; Green_EU RoHS: Passed; PackageReference: Red Miniature Testpoint; CompType: Test Point; LatestRevisionDate: 26/05/2017; PartNumber: 5000; ComponentLink1Description: Datasheet URL; Supplier Part Number 1: 36-5000-ND
U1 = CMP-0014092-2: Advanced eGaN FET 300V Half-bridge Drive, RVR0019A (WQFN-19); PartNumber: LMG1210RVR; Manufacturer: Texas Instruments; SizeArea_mm2: 12; SizeAreaWB_mm2: 20; SizeX_mm: 4; SizeY_mm: 3; SizeZ_mm: 0.8; CompType: IC; U/M: EA; PackageReference: RVR0019A; PackageDescription: WQFN-19; MountType: SMT; ComponentLink1Description: Datasheet Link; ComponentLink1URL: https://sps06.itg.ti.com/sites/KMS/crossdivteams/altium/docs/ComponentDatasheets/LMG1210_SNOSD12.pdf; Publisher: Texas Instruments; LatestRevisionDate: 2017-03-09; Alternate Manufacturer: Texas Instruments
U2#1 U2#2 = CMP-0051898-1: Dual Schmitt-Trigger Buffer, DBV0006A, LARGE T&R; Manufacturer: Texas Instruments; F @ Nom Voltage(Max)(Mhz): 150; VCC(Max)(V): 5.5; tpd @ Nom Voltage(Max)(ns): 9.3,5.7,5.4,4.3; Sub-Family: Non-Inverting Buffer/Driver; Output Drive (IOL/IOH)(Max)(mA): 32/-32; Output Type: CMOS; Voltage(Nom)(V): 1.8,2.5,3.3,5; ICC @ Nom Voltage(Max)(mA): 0.01; Schmitt Trigger: Yes; Technology Family: LVC; VCC(Min)(V): 1.65; 3-State Output: No; Rating: Catalog; Bits(#): 2; Input Type: CMOS/TTL; Logic: True; DatasheetVersion: SCES381N; Generic Part Number: SN74LVC2G17; PackageReference: DBV0006A; Operating Temperature Range(C): -40 to 125,-40 to 85
  U2#2: PartId: 2